# Altium schematic sheet MOSFET_V3.SchDoc
size B; SheetNumber: 6; SheetTotal: 8
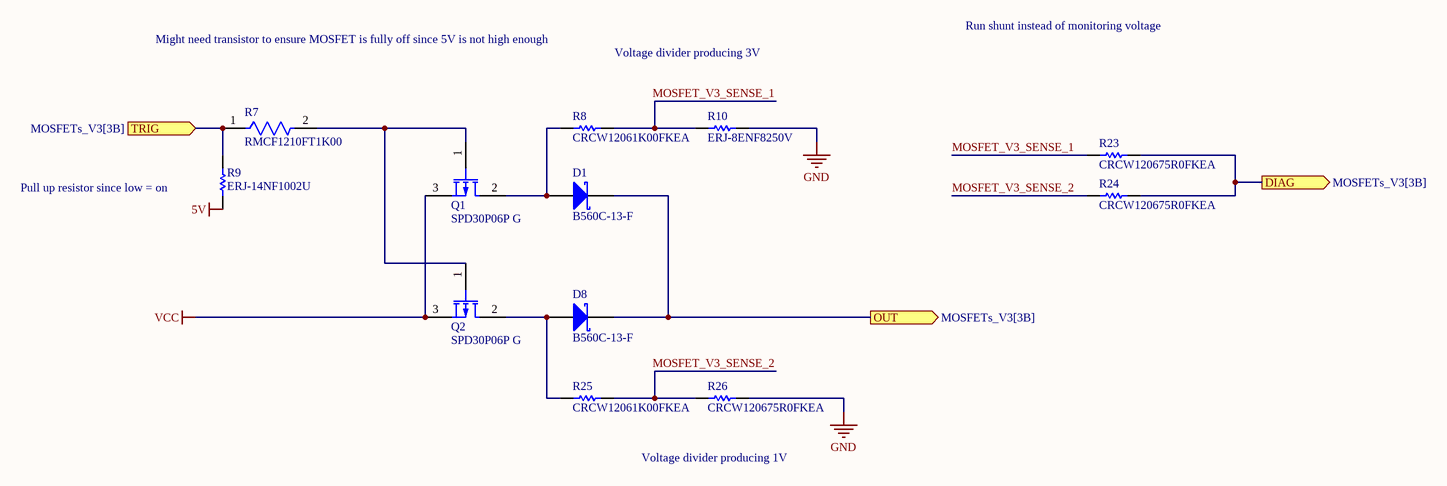
[diagram p0: MOSFET_V3.SchDoc]

## Parts
D1  B560C-13-F  [DIOD-B5X0C-2_M]
D8  B560C-13-F  [DIOD-B5X0C-2_M]
Q1  SPD30P06P G  [INF-PG-TO252-3-1_N]
Q2  SPD30P06P G  [INF-PG-TO252-3-1_N]
R7  RMCF1210FT1K00  [FP-RMCF1210-IPC_A]
R8  CRCW12061K00FKEA  [RESC3216X60X45ML15T20]
R9  ERJ-14NF1002U  [RESC3225X70X50NL20T20]
R10  ERJ-8ENF8250V  [RESC3216X70X50LL05T20]
R23  CRCW120675R0FKEA  [RESC3216X60X45NL10T20]
R24  CRCW120675R0FKEA  [RESC3216X60X45NL10T20]
R25  CRCW12061K00FKEA  [RESC3216X60X45ML15T20]
R26  CRCW120675R0FKEA  [RESC3216X60X45NL10T20]

## Ports
DIAG (out, see MOSFETs_V3[3B]), OUT (out, see MOSFETs_V3[3B]), TRIG (in, see MOSFETs_V3[3B])

## Nets
5V: R9.2
GND: R10.2 R26.2
VCC: Q1.3(S) Q2.3(S)
DIAG: R23.2 R24.2 ; port DIAG
MOSFET_V3_SENSE_1: R8.2 R10.1 R23.1
MOSFET_V3_SENSE_2: R24.1 R25.2 R26.1
OUT: D1.1(K) D8.1(K) ; port OUT
TRIG: R7.1 R9.1 ; port TRIG
NetD1_2: D1.2(A) Q1.2(D) R8.1
NetD8_2: D8.2(A) Q2.2(D) R25.1
NetQ1_1: Q1.1(G) Q2.1(G) R7.2

## Notes on the sheet
- Might need transistor to ensure MOSFET is fully off since 5V is not high enough
- Voltage divider producing 3V
- Run shunt instead of monitoring voltage
- (near R9) Pull up resistor since low = on
- Voltage divider producing 1V

## Library data of the parts
D1 D8 = CMP-2000-05098-2: Schottky Barrier Rectifier, 5 A, 60 V, -55 to 125 degC, 2-Pin SMD, RoHS, Tape and Reel; Ir - Reverse Current: 500uA; Configuration: Single; Ifsm - Forward Surge Current: 100A; Vrrm - Repetitive Reverse Voltage: 60V; Brand: DiodesIncorporated; Vf - Forward Voltage: 0.7V; If - Forward Current: 5A; Unit Weight: 0.007408oz; Type: SchottkyBarrierRectifier; Package / Case: SMC; Manufacturer URL: http://www.diodes.com/; Datasheet URL: https://datasheet.ciiva.com/27052/1538961-27052355.pdf; Factory Pack Quantity: 3000; Height: 2.5mm; Width: 6.22mm; Product Category: SchottkyDiodes&Rectifiers; Minimum Operating Temperature: -55C; Manufacturer: DiodesIncorporated; Datasheet Version: Rev. 7-2, 06/2007; Product: SchottkyDiodes; Maximum Operating Temperature: +125C; Operating Temperature Range: -55Cto+125C; Technology: Si; Length: 7.11mm; RoHS: True; Packaging: Reel; Termination Style: SMD/SMT; Series: B560; Mounting Style: SMD/SMT
Q1 Q2 = CMP-1099-00058-1: P-Channel SIPMOS Power-Transistor, -60 V VDS, -30 A ID, -55 to 175 degC, PG-TO252-3-1, Reel, Green; Manufacturer: Infineon; Pto t (max): 125Â W; RDS (on) (max): 75Â mOhm; VGS(th) (max): -4Â V; Green: TRUE; ID (max): -30Â A; QG: 32Â nC; VDS (max): -60Â V; VGS(th) (min): -2.1Â V; RthJC (max): 1.2Â K/W; IDpuls (max): -120Â A; ComponentLink1Description: Manufacturer URL; Packing: Reel; ComponentLink2Description: Datasheet; ComponentLink1URL: http://www.infineon.com/; ComponentLink3Description: Package Specification; PackageDescription: 3-Pin Plastic (Green) Transistor Single Outline Package, 6.5 x 6.12 mm Body, 2.28 mm Pitch; Mounting Technology: Surface Mount; ComponentLink3URL: http://www.infineon.com/dgdl/TLE42744_DS_11.pdf?folderId=db3a304318f3fe290118f5a433570040&fileId=db3a304327b897500128012ccafe37d2&sId=db3a30443d67b5ca013d83f7c0ea327b; Rth: 1.2Â K/W; ComponentLink2URL: http://www.infineon.com/dgdl/SPD30P06P_Rev.2.3_pdf.pdf?folderId=db3a30431ed1d7b2011f4042f2ff4ec5&fileId=db3a30431ed1d7b2011f404fbc7e4ef4; PartNumber: SPD30P06P G; PackageReference: PG-TO252-3-1; DatasheetVersion: Rev. 2.3; PackageVersion: Jan-10
R7 = CMP-26527-007195-1: 1kΩ ±1% 0.5W 1210 Thick Film Chip Resistor AEC-Q200 compliant; Max Power Dissipation: 333mW; Temperature Coefficient: 100ppm/°C; Resistance: 1kR; Lead Free: Lead Free; Radiation Hardening: No; Min Operating Temperature: -55°C; RoHS Compliant: Yes; Length: 3.2mm; Height: 0.028inch; Contact Plating: Tin; Resistor Type: Thick Film; Case Code (Metric): 3225; Case Code (Imperial): 1210; Military Standard: Not; Tolerance: 1%; Series: RMCF; Features: Automotive AEC-Q200; Case/Package: 1210; Max Operating Temperature: 155°C; Construction: Rectangular; Number of Terminations: 2; Width: 0.098inch; Depth: 2.5mm; Mount: Surface Mount; Packaging: Tape and Reel
R8 R25 = CMP-2100-03616-1: Chip Resistor, 1 KOhm, +/- 1%, 0.25 W, -55 to 155 degC, 1206 (3216 Metric), RoHS, Tape and Reel; Manufacturer: Vishay Semiconductor; Power Rating: 250mW; Voltage Rating (DC): 200V; Resistance: 1KOhm; Temperature Coefficient: 100ppm/degreesC; Case Code (Imperial): 1206; Length: 3.2mm; Case/Package: 1206; Contact Plating: Tin; Package Quantity: 10; Datasheet URL: http://www.farnell.com/datasheets/1720486.pdf; Mount: SurfaceMount; Package Description: 2-Pin Surface Mount Device, Body 3.15 x 1.6 mm; Package Reference: 1206.0; Max Operating Temperature: 155degC; Lead Free: LeadFree; Weight: 0.000353oz; Military Standard: Not; Max Power Dissipation: 250mW; Case Code (Metric): 3216; Number of Terminations: 2; Tolerance: 1%; Width: 0.063inch; Termination: SMD/SMT; Number of Pins: 2; Min Operating Temperature: -55degC; Height: 0.55mm; Depth: 1.6mm; RoHSCompliant: true; Composition: ThickFilm; Packaging: TapeandReel; Manufacturer URL: http://www.vishay.com/; Voltage Rating: 200V; Radiation Hardening: No; REACH SVHC: Unknown; Datasheet Version: 41061.0
R9 = CMP-1015-00623-2: Manufacturer: Panasonic; Part Number: ERJ-14NF1002U
R10 = CMP-2003-00507-1: Manufacturer: Panasonic; Part Number: ERJ-8ENF8250V
R23 R24 R26 = CMP-2003-02378-1: Manufacturer: Vishay Dale; Part Number: CRCW120675R0FKEA